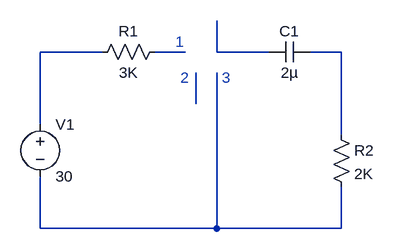
[diagram p0: schematic EJ9_teoría.asc]
EJ9_teoría.asc, the LTspice schematic file:
Version 4.1
SHEET 1 920 680
WIRE -96 -288 -192 -288
WIRE 32 -288 -16 -288
WIRE 80 -288 80 -336
WIRE 160 -288 80 -288
WIRE 272 -288 224 -288
WIRE 48 -208 48 -256
WIRE -192 -176 -192 -288
WIRE 272 -160 272 -288
WIRE -192 -16 -192 -96
WIRE 80 -16 80 -256
WIRE 80 -16 -192 -16
WIRE 272 -16 272 -80
WIRE 272 -16 80 -16
SYMBOL res 0 -304 R90
WINDOW 0 0 56 VBottom 2
WINDOW 3 32 56 VTop 2
SYMATTR InstName R1
SYMATTR Value 3K
SYMBOL voltage -192 -192 R0
SYMATTR InstName V1
SYMATTR Value 30
SYMBOL cap 224 -304 R90
WINDOW 0 0 32 VBottom 2
WINDOW 3 32 32 VTop 2
SYMATTR InstName C1
SYMATTR Value 2µ
SYMBOL res 256 -176 R0
SYMATTR InstName R2
SYMATTR Value 2K
TEXT 24 -248 Left 2 ;2
TEXT 88 -248 Left 2 ;3
TEXT 16 -304 Left 2 ;1

The netlist it stands for:
* EJ9_teoría.asc
R1 N002 N001 3K
V1 N001 N006 30
C1 N004 N003 2µ
R2 N004 N006 2K
* 2
* 3
* 1
.backanno
.end